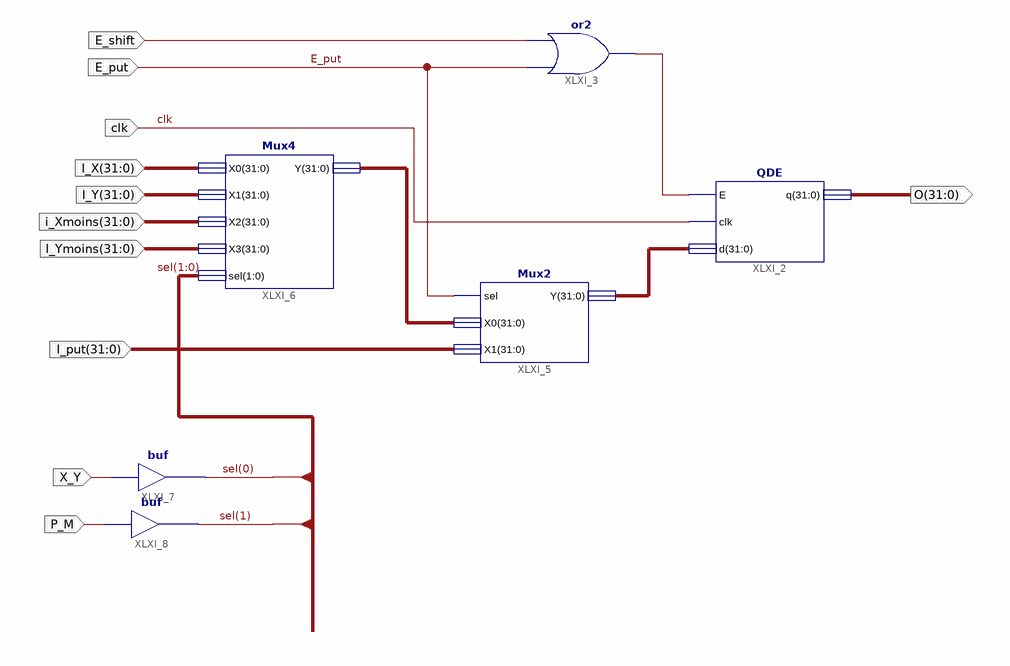
[diagram p0: schematic sheet 1]
// Xilinx ISE schematic netring.sch (spartan6) as structural Verilog: 6 symbols, 11 ports
module netring (
  input  [31:0] I_Y,
  input  clk,
  input  [31:0] I_put,
  input  E_shift,
  input  E_put,
  input  [31:0] I_X,
  input  [31:0] i_Xmoins,
  input  [31:0] I_Ymoins,
  input  X_Y,
  input  P_M,
  output [31:0] O
);

  wire XLXN_19;
  wire [1:0] sel;
  wire [31:0] XLXN_20, XLXN_23;

  QDE XLXI_2 (.E(XLXN_19), .clk(clk), .d(XLXN_20), .q(O));
  or XLXI_3 (XLXN_19, E_put, E_shift);
  Mux2 XLXI_5 (.sel(E_put), .X0(XLXN_23), .X1(I_put), .Y(XLXN_20));
  Mux4 XLXI_6 (.X0(I_X), .X1(I_Y), .X2(i_Xmoins), .X3(I_Ymoins), .sel(sel), .Y(XLXN_23));
  buf XLXI_7 (sel[0], X_Y);
  buf XLXI_8 (sel[1], P_M);
endmodule
